# Altium schematic sheet MiniBall.SchDoc
size Letter; CompanyName: Ploopy Corporation; Organization: Ploopy Corporation; Address1: 137-1140 Burnhamthorpe Road W; Address2: Mississauga; Address3: Ontario; Address4: Canada L5C 0A3; DocumentNumber: 1; Revision: R1.001; SheetNumber: 1; SheetTotal: 5
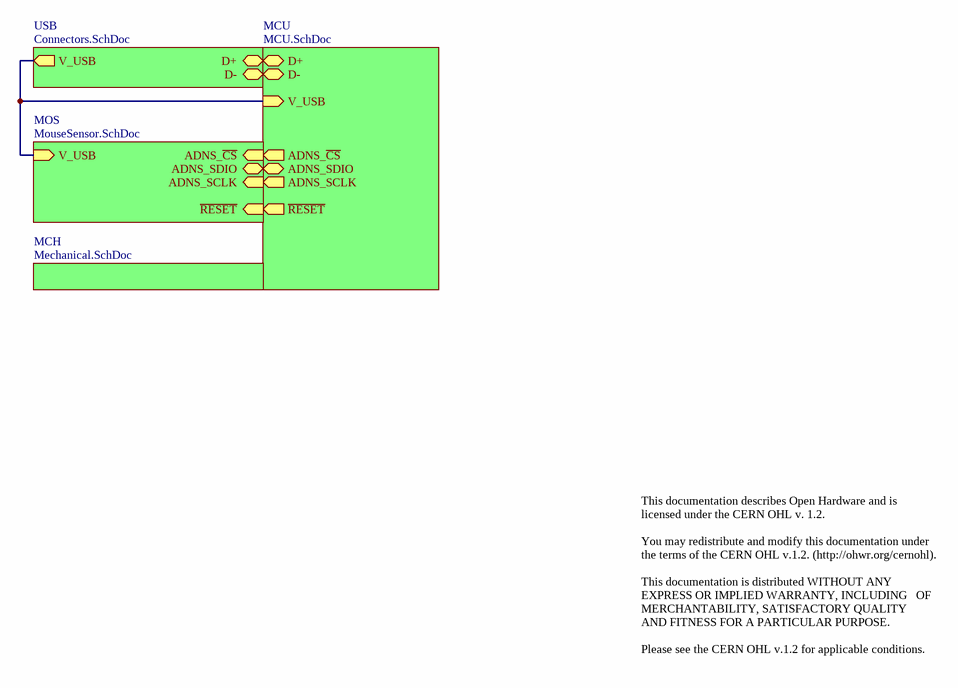
[diagram p0: MiniBall.SchDoc]

## Sub-sheets
MCH = Mechanical.SchDoc: no entries
MCU = MCU.SchDoc: D+ (bidir), D- (bidir), V_USB (in), ~{RESET} (out), ADNS_SDIO (bidir), ADNS_~{CS} (out), ADNS_SCLK (out)
MOS = MouseSensor.SchDoc: ~{RESET} (in), V_USB (in), ADNS_~{CS} (in), ADNS_SDIO (bidir), ADNS_SCLK (in)
USB = Connectors.SchDoc: D+ (bidir), V_USB (out), D- (bidir)

## Nets
(unnamed): sheet USB/D+, sheet MCU/D+
(unnamed): sheet USB/V_USB, sheet MCU/V_USB, sheet MOS/V_USB
(unnamed): sheet USB/D-, sheet MCU/D-
(unnamed): sheet MCU/~{RESET}, sheet MOS/~{RESET}
(unnamed): sheet MCU/ADNS_SDIO, sheet MOS/ADNS_SDIO
(unnamed): sheet MCU/ADNS_~{CS}, sheet MOS/ADNS_~{CS}
(unnamed): sheet MCU/ADNS_SCLK, sheet MOS/ADNS_SCLK

## Notes on the sheet
- This documentation describes Open Hardware and is licensed under the CERN OHL v. 1.2.
  You may redistribute and modify this documentation under the terms of the CERN OHL v.1.2. (http://ohwr.org/cernohl).
  This documentation is distributed WITHOUT ANY EXPRESS OR IMPLIED WARRANTY, INCLUDING   OF MERCHANTABILITY, SATISFACTORY QUALITY   AND FITNESS FOR A PARTICULAR PURPOSE.
  Please see the CERN OHL v.1.2 for applicable conditions.
- Copyright Ploopy Corporation 2021
- Licensed under the CERN OHL v. 1.2
- http://ohwr.org/cernohl
- Title:
- PCB:
- Version:
- Ploopy Corporation
- Mississauga ON L5C 0A3
- 137-1140 Burnhamthorpe Road W
- Date:
- Time:
- Sheet
- of
- Canada